# Altium project Main Board.PrjPcb
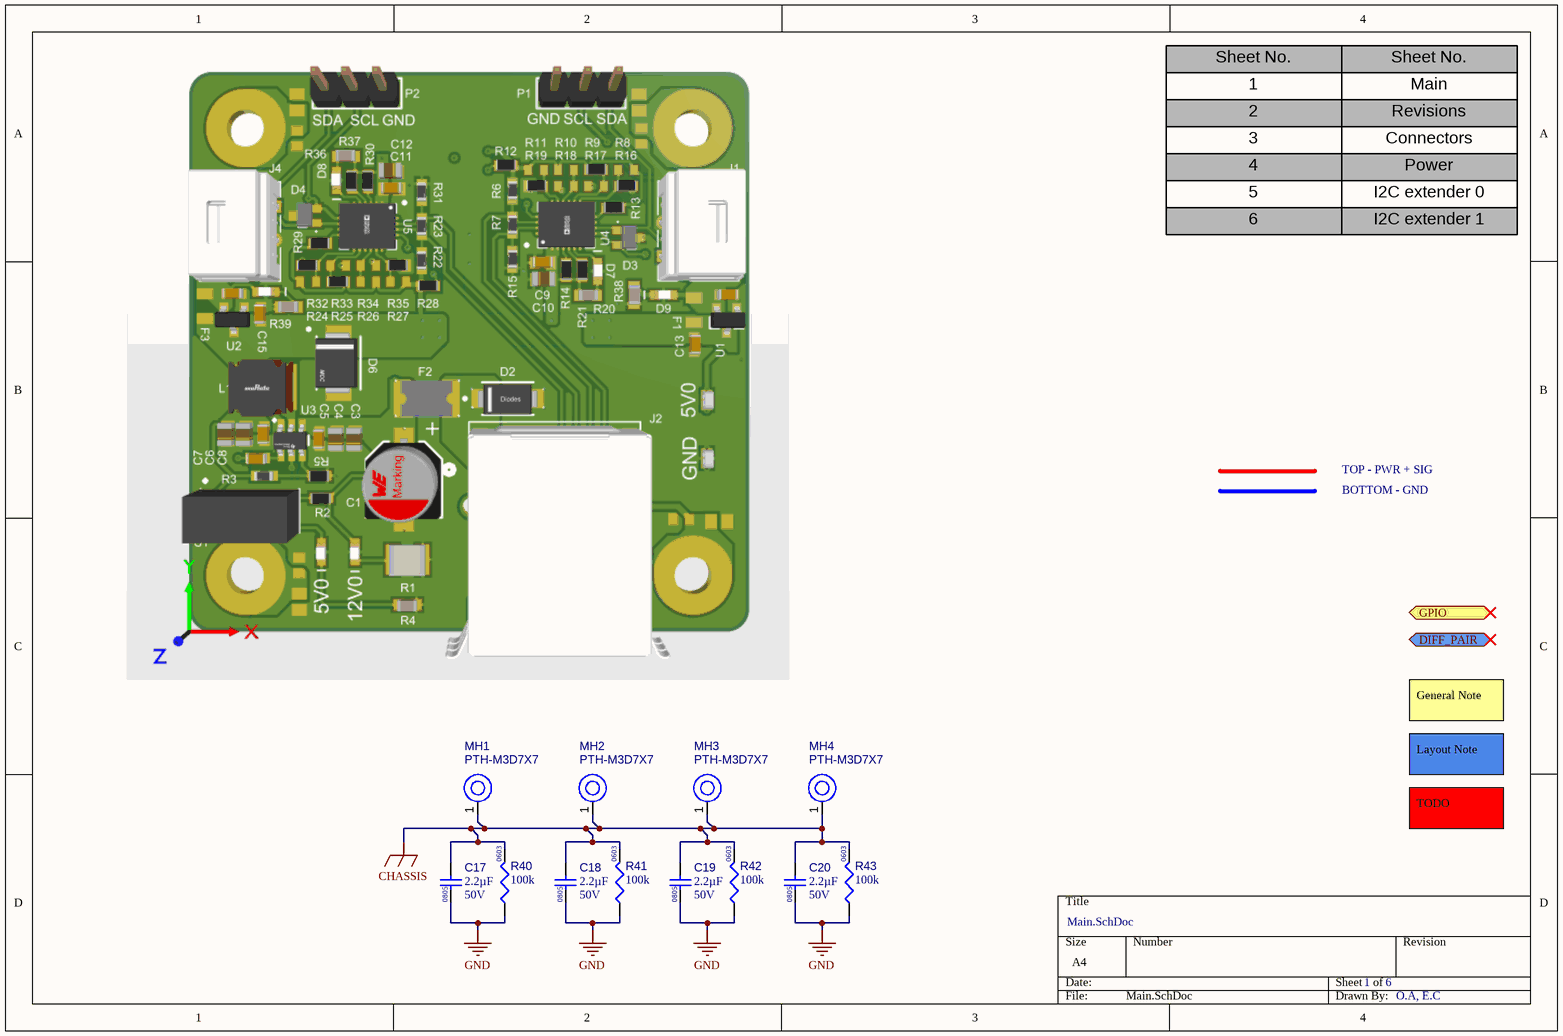
[diagram p0: Main.SchDoc]
5 sheets, 94 parts. Net scope: flat (ports and power ports of the same name join across sheets).
Board file: PCB.PcbDoc
Sheets:
  Main.SchDoc
  Connectors.SchDoc
  Power.SchDoc
  I2C extender 0.SchDoc
  I2C extender 1.SchDoc

## Sheet Main.SchDoc: =DocumentName
size A4; SheetNumber: 1; SheetTotal: 6

### Parts
C17  value 2.2µF  Rated DC Voltage (URdc): 50V  Case/Package: 0805  [FP-CL21-IPC_C]  (hidden comment: CL21A225KBFNNNE)
C18  value 2.2µF  Rated DC Voltage (URdc): 50V  Case/Package: 0805  [FP-CL21-IPC_C]  (hidden comment: CL21A225KBFNNNE)
C19  value 2.2µF  Rated DC Voltage (URdc): 50V  Case/Package: 0805  [FP-CL21-IPC_C]  (hidden comment: CL21A225KBFNNNE)
C20  value 2.2µF  Rated DC Voltage (URdc): 50V  Case/Package: 0805  [FP-CL21-IPC_C]  (hidden comment: CL21A225KBFNNNE)
MH1  PTH-M3D7X7  [PTH-M2D5X5]
MH2  PTH-M3D7X7  [PTH-M2D5X5]
MH3  PTH-M3D7X7  [PTH-M2D5X5]
MH4  PTH-M3D7X7  [PTH-M2D5X5]
R40  value 100k  Case/Package: 0603  [RESC1608X55X25NL10T15]  (hidden comment: RC0603FR-07100KL)
R41  value 100k  Case/Package: 0603  [RESC1608X55X25NL10T15]  (hidden comment: RC0603FR-07100KL)
R42  value 100k  Case/Package: 0603  [RESC1608X55X25NL10T15]  (hidden comment: RC0603FR-07100KL)
R43  value 100k  Case/Package: 0603  [RESC1608X55X25NL10T15]  (hidden comment: RC0603FR-07100KL)

### Ports
DIFF_PAIR (bidir), GPIO (bidir)

### Nets
CHASSIS: C17.2 C18.2 C19.2 C20.2 MH1.1(H1) MH2.1(H1) MH3.1(H1) MH4.1(H1) R40.2 R41.2 R42.2 R43.2
GND: C17.1 C18.1 C19.1 C20.1 R40.1 R41.1 R42.1 R43.1

### Notes on the sheet
- Sheet No.
- 1
- Main
- 2
- 3
- 4
- Revisions
- Connectors
- Power
- 5
- 6
- I2C extender 0
- I2C extender 1
- TOP - PWR + SIG
- BOTTOM - GND
- General Note
- Layout Note
- TODO
- O.A, E.C

### Library data of the parts
C17-C20 = CMP-001-00099-1: Ceramic Capacitor, Multilayer, Ceramic, 50V, 10% +Tol, 10% -Tol, X5R, 15% TC, 2.2uF, Surface Mount, 0805; Multilayer: Yes; Dielectric Material: Ceramic; Length: 2mm; Pins: 2; Tolerance  (fill in as +-): 10%; RoHS Compliant: Yes; Package Style: SMTMeter; Reach SVHC Compliant: Yes; Min Operating Temperature: -55°C; Temperature Characteristics Code: X5R; Tolerance (fill in as +-): 10%; Capacitor Type: Ceramic; Width: 1.25mm; Terminal Finish: Nickel; Termination: Wraparound; Package Shape: Rectangular; Packaging: Tape and Reel; Mounting Technology: Surface Mount; JESD-609 Code: e3; Height: 1.25mm; Max Operating Temperature: 85°C
MH1-MH4 = CMP-00028-00009-3: M3 PTH (3.3mm), 7mm pad; Pins: 1
R40-R43 = CMP-009-00195-1: Fixed Resistor, Metal Glaze/thick Film, 0.1W, 100000ohm, 75V, 1% +/-Tol, 100ppm/Cel, Surface Mount, 0603; Power: 100mW; Voltage Rating: 50V; Package Length: 1.6mm; Package Height: 0.45mm; Rated Temperature: 70°C; Package Width: 0.8mm; Temperature Coefficient: 100ppm/°C; Additional Feature: LASER TRIMMABLE; Pins: 2; Reach SVHC Compliant: Yes; Terminal Finish: Nickel; RoHS Compliant: Yes; Technology: METAL GLAZE/THICK FILM; JESD-609 Code: e3; Working Voltage: 75V; Construction: Chip; Mounting Technology: Surface Mount; Package Style: SMTMeter; Packaging: Tape and Reel; Min Operating Temperature: -55°C; Termination: Wraparound; Tolerance: 1%; Package Shape: Rectangular; Max Operating Temperature: 155°C; Resistor Type: FIXED RESISTOR

## Sheet Connectors.SchDoc
size A4; SheetNumber: 3; SheetTotal: 6
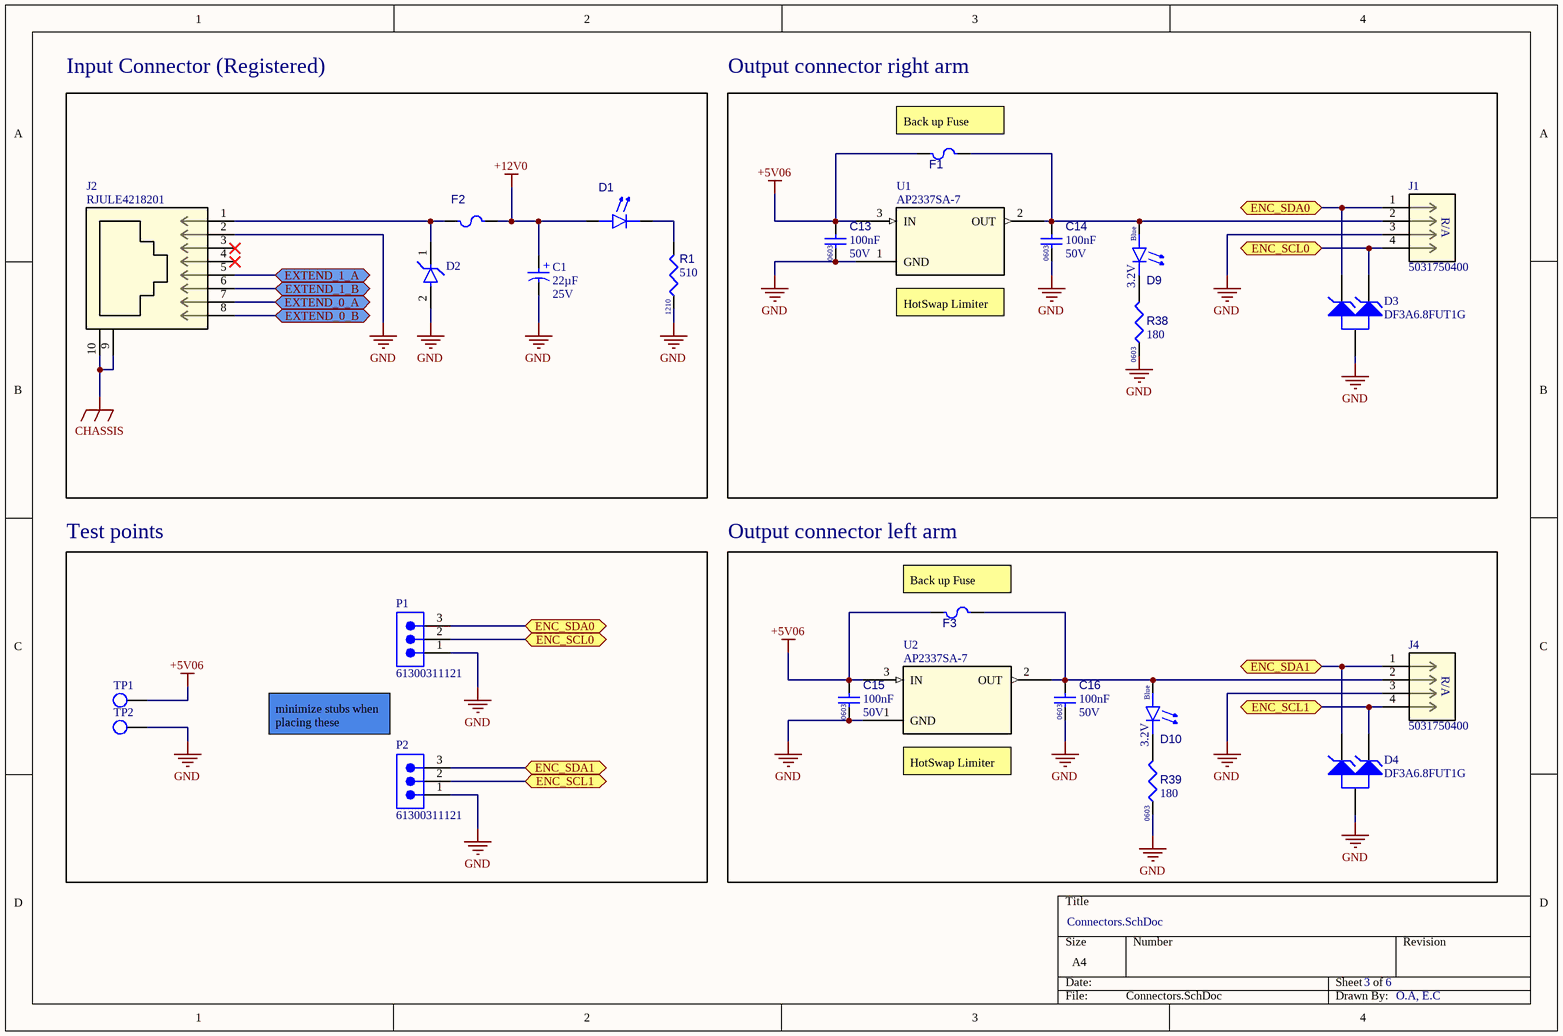
[diagram p1: Connectors.SchDoc]

### Parts
C1  value 22µF  Voltage Rating: 25V  [WCAP-PSLP_D6.3H5.8]  (hidden comment: 875105544003)
C13  value 100nF  Voltage Rating: 50V  Case/Package: 0603  [CAPC1608X90X40NL10T20]  (hidden comment: Capacitor 100 nF +/-10% 50 V 0603)
C14  value 100nF  Voltage Rating: 50V  Case/Package: 0603  [CAPC1608X90X40NL10T20]  (hidden comment: Capacitor 100 nF +/-10% 50 V 0603)
C15  value 100nF  Voltage Rating: 50V  Case/Package: 0603  [CAPC1608X90X40NL10T20]  (hidden comment: Capacitor 100 nF +/-10% 50 V 0603)
C16  value 100nF  Voltage Rating: 50V  Case/Package: 0603  [CAPC1608X90X40NL10T20]  (hidden comment: Capacitor 100 nF +/-10% 50 V 0603)
D1  150060RS75000  [WL-SMCW_0603_150060xx75000]  (value not drawn)
D2  SMAJ5.0A-13-F  [FP-SMA-MFG]  (value not drawn)
D3  DF3A6.8FUT1G  [ONSC-SC-70-3-419-04_V]
D4  DF3A6.8FUT1G  [ONSC-SC-70-3-419-04_V]
D9  Nominal Vf: 3.2V  Color: Blue  [WL-SMCW_0603_150060xx75000]  (hidden comment: 150060BS75000)
D10  Nominal Vf: 3.2V  Color: Blue  [WL-SMCW_0603_150060xx75000]  (hidden comment: 150060BS75000)
F1  MF-PSMF050X-2  [FP-MF-PSMF-MFG]  (value not drawn)
F2  MF-MSMF075-2  [BOUR-MF-MSMF050-2_V]  (value not drawn)
F3  MF-PSMF050X-2  [FP-MF-PSMF-MFG]  (value not drawn)
J1  5031750400  [5031750400-Footprint-1]
J2  RJULE4218201  [RJULE4218201-Footprint-1]
J4  5031750400  [5031750400-Footprint-1]
P1  61300311121  [61300311121]
P2  61300311121  [61300311121]
R1  value 510  Case/Package: 1210  [RESC3126X60X50NL10T20]  (hidden comment: RC1210JR-07510RL)
R38  value 180  Case/Package: 0603  [RESC0603(1608)_N]  (hidden comment: RC0603JR-07180RL)
R39  value 180  Case/Package: 0603  [RESC0603(1608)_N]  (hidden comment: RC0603JR-07180RL)
TP1  RCUCTE  [FP-S2761-46R-MFG]  (value not drawn)
TP2  RCUCTE  [FP-S2761-46R-MFG]  (value not drawn)
U1  AP2337SA-7  [SOT90P240X120-3L]
U2  AP2337SA-7  [SOT90P240X120-3L]

### Blocks framed on the sheet
Input Connector (Registered): C1 D1 D2 F2 J2 R1
Output connector right arm: C13 C14 D3 D9 F1 J1 R38 U1
Test points: P1 P2 TP1 TP2
Output connector left arm: C15 C16 D4 D10 F3 J4 R39 U2

### Ports
ENC_SCL0 (bidir), ENC_SCL1 (bidir), ENC_SDA0 (bidir), ENC_SDA1 (bidir), EXTEND_0_A (bidir), EXTEND_0_B (bidir), EXTEND_1_A (bidir), EXTEND_1_B (bidir)

### Nets
+5V06: C13.2 C15.2 F1.2 F3.2 TP1.1 U1.3(IN) U2.3(IN)
+12V0: C1.1(P) D1.2(A) F2.2
CHASSIS: J2.9 J2.10
GND: C1.2(N) C13.1 C14.1 C15.1 C16.1 D2.2(A) D3.3(A) D4.3(A) J1.3 J2.2 J4.3 P1.1 P2.1 R1.1 R38.1 R39.1 TP2.1 U1.1(GND) U2.1(GND)
NetC14_2: C14.2 D9.2(A) F1.1 J1.2 U1.2(OUT)
NetC16_2: C16.2 D10.2(A) F3.1 J4.2 U2.2(OUT)
NetD1_1: D1.1(K) R1.2
NetD2_1: D2.1(C) F2.1 J2.1
NetD3_1: D3.1(K1) J1.1 P1.3 ; port ENC_SDA0
NetD3_2: D3.2(K2) J1.4 P1.2 ; port ENC_SCL0
NetD4_1: D4.1(K1) J4.1 P2.3 ; port ENC_SDA1
NetD4_2: D4.2(K2) J4.4 P2.2 ; port ENC_SCL1
NetD9_1: D9.1(K) R38.2
NetD10_1: D10.1(K) R39.2
NetJ2_5: J2.5 ; port EXTEND_1_A
NetJ2_6: J2.6 ; port EXTEND_1_B
NetJ2_7: J2.7 ; port EXTEND_0_A
NetJ2_8: J2.8 ; port EXTEND_0_B

Not connected (* = marked no-connect by the designer): J2 3* 4*

### Notes on the sheet
- (near F1) Back up Fuse
- (near U1) HotSwap Limiter
- (near F3) Back up Fuse
- minimize stubs when placing these
- (near U2) HotSwap Limiter
- O.A, E.C
- (in symbol CMP-001-00085-2) +
- (in symbol CMP-002-00074-2) R/A

### Library data of the parts
C1 = CMP-001-00085-2: 22 µF 25 V Aluminum - Polymer Capacitors Radial, Can - SMD 30mOhm 2000 Hrs @ 105°C; Tolerance: 20%; Capacitor Type: Aluminium; Pins: 2; RoHS Compliant: Yes
C13-C16 = CMP-001-00017-8: Chip Capacitor, 100 nF, +/- 10%, 50 V, 0603 (1608 Metric); Capacitor Type: Ceramic; Tolerance: 10%; Mounting Technology: SM; Max Operating Temperature: 125°C; RoHS Compliant: True; Pins: 2; Min Operating Temperature: -55°C
D1 = CMP-007-00036-1: Single Color LED, Red, Water Clear, 1.1mm; Forward Current: 30mA; Max Operating Temperature: 85°C; Mounting Technology: Surface Mount; RoHS Compliant: Yes; Pins: 2; Min Operating Temperature: -40°C
D2 = CMP-004-00031-3: Trans Voltage Suppressor Diode, 400W, 5V V(RWM), Unidirectional, 1 Element, Silicon; RoHS Compliant: Yes; Max Operating Temperature: 150°C; Min Operating Temperature: -55°C; Pins: 2
D3 D4 = CMP-004-00039-1: Trans Voltage Suppressor Diode, 150W, Unidirectional, 2 Element, Silicon; Dynamic Impedance-Max: 50R; Time @ Peak Reflow Temperature-Max (s): 40s; Test Current: 5mA; Max Power Dissipation: 200mW; Package Body Material: Plastic; Number of Elements: 2; Voltage Tol-Max: 5.9%; Max Breakdown Voltage: 7.2V; Qualification Status: Not Qualified; Min Breakdown Voltage: 6.4V; Reference Voltage-Nom: 6.8V; Terminal Form: Gull Wing; Reach SVHC Compliant: Yes; Package Shape: Rectangular; Terminal Finish: Tin; Terminal Position: DUAL; JESD-609 Code: e3; Non-rep Peak Rev Power Dis-Max: 150W; Surface Mount: Yes; Diode Type: TRANS VOLTAGE SUPPRESSOR; Technology: ZENER; Polarity: Unidirectional; Max Operating Temperature: 150°C; Moisture Sensitivity Level: 1; Diode Element Material: SILICON; Min Operating Temperature: -55°C; Package Style: SMALL OUTLINEMeter; Pins: 3; Peak Reflow Temperature (Cel): 260°C; JESD-30 Code: R-PDSO-G3; RoHS Compliant: Yes
D9 D10 = CMP-007-00037-2: Single Color LED, Blue, Water Clear, 1.1mm; Channels: 1; Luminous Intensity-Nom: 145mcd; Overall Height: 0.7mm; Shape: Rectangular; Viewing Angle: 140°; Forward Current: 30mA; Pins: 2; Lens Style: WATER CLEAR; Mounting Technology: Surface Mount; Optoelectronic Device Type: SINGLE COLOR LED; Packaging: Tape and Reel; RoHS Compliant: Yes; Colour: Blue; Terminal Pitch: 1.6mm; Min Operating Temperature: -40°C; Size: 1.1mm; Reach SVHC Compliant: Yes; Max Operating Temperature: 85°C
F1 F3 = CMP-005-00014-1: PTC Resettable Fuse, 6V, Surface Mount; Power: 500mW; Thermistor Application: OVERLOAD PROTECTION; Min Operating Temperature: -40°C; Pins: 2; Reach SVHC Compliant: Yes; Resistor Type: PTC RESETTABLE FUSE; JESD-609 Code: e4; RoHS Compliant: Yes; Packaging: Tape and Reel; Max Operating Temperature: 85°C; Package Shape: Rectangular; Mounting Technology: Surface Mount; Termination: Wraparound; Terminal Placement: Dual Ended; Terminal Finish: Nickel; Rated AC Voltage (URac): 6V
F2 = CMP-005-00013-2: PTC Resettable Fuse, 13.2V, Surface Mount; Reference Standard: AEC-Q200; Thermistor Application: OVERLOAD PROTECTION; Package Length: 4.73mm; Package Width: 3.41mm; Package Height: 0.85mm; Power: 800mW; Rated Temperature: 85°C; Min Operating Temperature: -40°C; Rated AC Voltage (URac): 13.2V; Terminal Finish: Nickel; Termination: Wraparound; Packaging: Tape and Reel; Package Shape: Rectangular; Resistor Type: PTC RESETTABLE FUSE; Max Operating Temperature: 85°C; Reach SVHC Compliant: Yes; Pins: 2; JESD-609 Code: e4; RoHS Compliant: Yes; Terminal Placement: Dual Ended; Mounting Technology: Surface Mount; Package Style: SMTMeter
J1 J4 = CMP-002-00074-2: DIP Connector, 4 Contact(s), 2 Row(s), Female, Right Angle, 0.059 inch Pitch, Solder Terminal, Locking, Beige Insulator, Receptacle; Connector Type: DIP; Min Operating Temperature: -85°C; Mounting Technology: Board; RoHS Compliant: Yes; Max Operating Temperature: 85°C
J2 = CMP-002-00075-4: Modular Jack - Right Angle, Input Output Connectors RJ45, 8P8C, Without LEDs, Shield.
P1 P2 = CMP-002-00076-1: Board Connector, 3 Contact(s), 1 Row(s), Male, Straight, 0.1 inch Pitch, Solder Terminal, Locking, Black Insulator, Plug; Min Operating Temperature: -40°C; Connector Type: BOARD CONNECTOR; RoHS Compliant: Yes; Mounting Technology: Board; Max Operating Temperature: 125°C
R1 = CMP-009-00179-1: Fixed Resistor, Metal Glaze/thick Film, 0.5W, 510ohm, 200V, 5% +/-Tol, 100ppm/Cel, Surface Mount, 1210; Power: 500mW; Pins: 2; Min Operating Temperature: -55°C; Mounting Technology: Surface Mount; Max Operating Temperature: 155°C; RoHS Compliant: Yes; Tolerance: 5%
R38 R39 = CMP-009-00178-1: Fixed Resistor, Metal Glaze/thick Film, 0.1W, 180ohm, 75V, 5% +/-Tol, 100ppm/Cel, Surface Mount, 0603; Power: 100mW; Tolerance: 5%; Pins: 2; Mounting Technology: Surface Mount; RoHS Compliant: Yes; Max Operating Temperature: 155°C; Min Operating Temperature: -55°C
TP1 TP2 = CMP-002-00072-5: Test point; Connector Type: Interconnection Device; Pins: 2; Max Operating Temperature: 125°C; Case/Package: 0603; Mounting Technology: Surface Mount; RoHS Compliant: Yes; Min Operating Temperature: -55°C
U1 U2 = CMP-015-00012-4: Power Supply Support Circuit, Fixed, 1 Channel, PDSO3; Adjustable Threshold: No; Qualification Status: Not Qualified; Max Supply Voltage: 5.5V; Channels: 1; Min Supply Voltage: 2.7V; Package Body Material: Plastic; Time @ Peak Reflow Temperature-Max (s): 40s; Nominal Supply Voltage: 5V; Peak Reflow Temperature (Cel): 260°C; JESD-609 Code: e3; Length: 2.9mm; Surface Mount: Yes; Case/Package: SOP; Package Shape: Rectangular; RoHS Compliant: Yes; Moisture Sensitivity Level: 1; Temperature Grade: INDUSTRIAL; Number of Channels: 1; Package Style: SMALL OUTLINEMeter; Width: 1.3mm; Max Operating Temperature: 85°C; JESD-30 Code: R-PDSO-G3; Height - Seated (Max): 1.2mm; Terminal Position: DUAL; Pins: 3; Min Operating Temperature: -40°C; Terminal Finish: Tin; Throw Configuration: POWER SUPPLY SUPPORT CIRCUIT; Reach SVHC Compliant: Yes; Terminal Pitch: 0.915mm; Terminal Form: Gull Wing

## Sheet Power.SchDoc
size A4; SheetNumber: 4; SheetTotal: 6
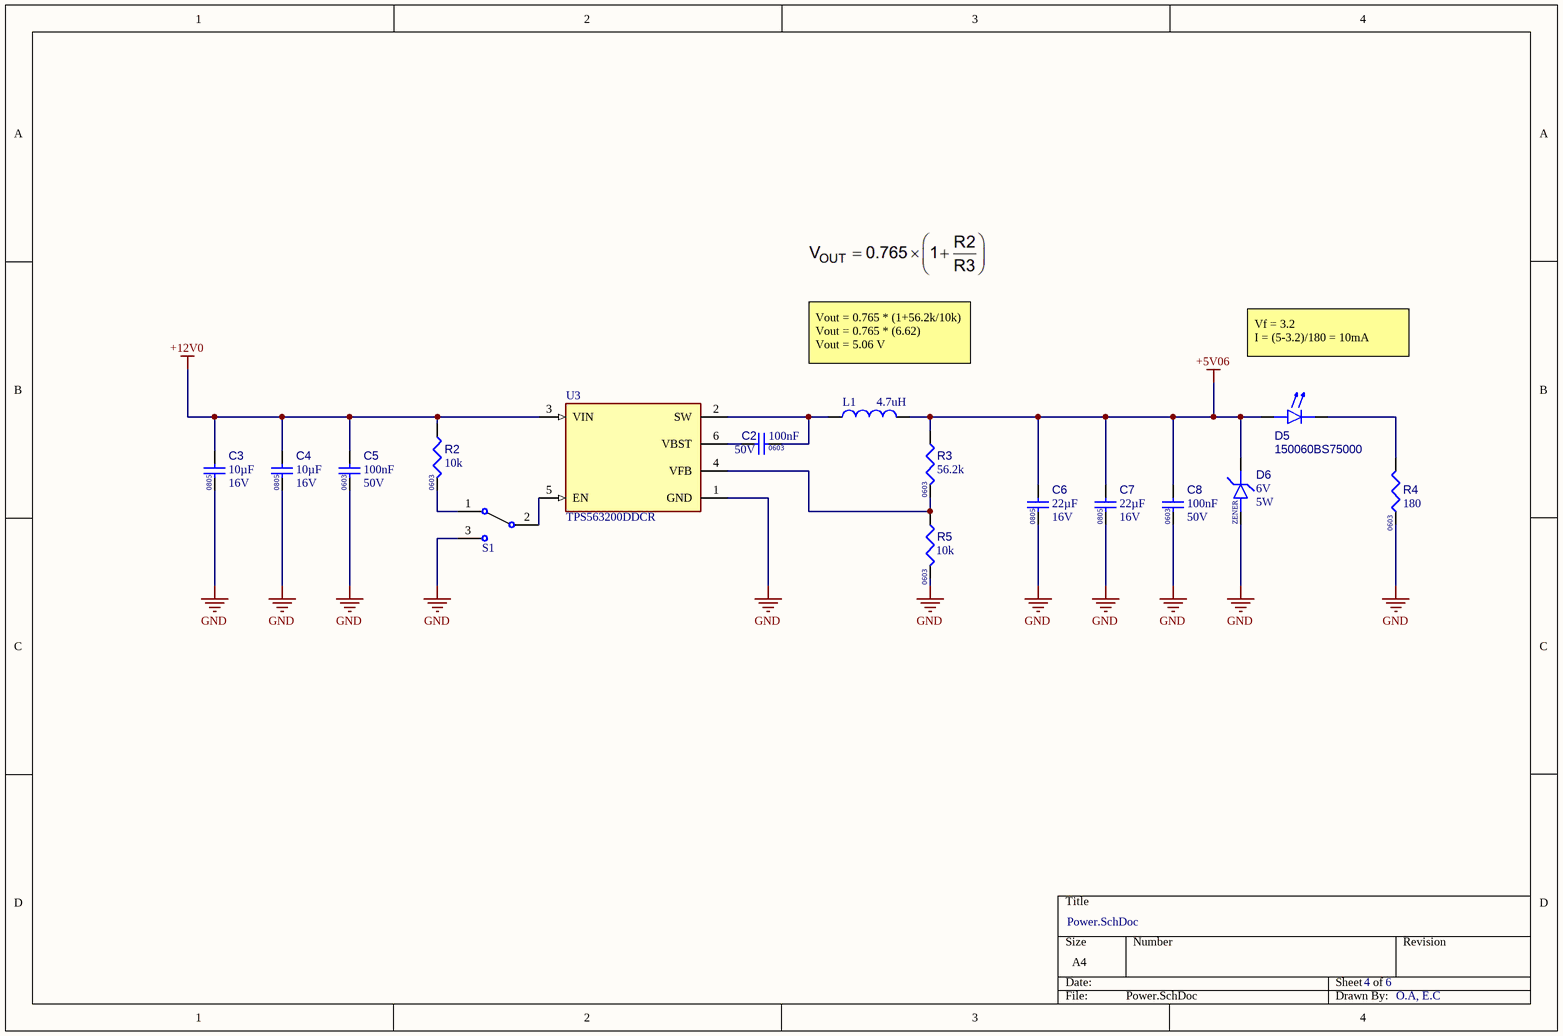
[diagram p2: Power.SchDoc]

### Parts
C2  value 100nF  Voltage Rating: 50V  Case/Package: 0603  [CAPC1608X90X40NL10T20]  (hidden comment: Capacitor 100 nF +/-10% 50 V 0603)
C3  value 10µF  Voltage Rating: 16V  Case/Package: 0805  [CAP CER 10UF 16V X5R 0805-Footprint-1]  (hidden comment: CAP CER 10UF 16V X5R 0805)
C4  value 10µF  Voltage Rating: 16V  Case/Package: 0805  [CAP CER 10UF 16V X5R 0805-Footprint-1]  (hidden comment: CAP CER 10UF 16V X5R 0805)
C5  value 100nF  Voltage Rating: 50V  Case/Package: 0603  [CAPC1608X90X40NL10T20]  (hidden comment: Capacitor 100 nF +/-10% 50 V 0603)
C6  value 22µF  Voltage Rating: 16V  Case/Package: 0805  [CL21A226MOQNNNE-Footprint-1]  (hidden comment: CL21A226MOQNNNE)
C7  value 22µF  Voltage Rating: 16V  Case/Package: 0805  [CL21A226MOQNNNE-Footprint-1]  (hidden comment: CL21A226MOQNNNE)
C8  value 100nF  Voltage Rating: 50V  Case/Package: 0603  [CAPC1608X90X40NL10T20]  (hidden comment: Capacitor 100 nF +/-10% 50 V 0603)
D5  150060BS75000  [WL-SMCW_0603_150060xx75000]
D6  Reference Voltage-Nom: 6V  Max Power Dissipation: 5W  Diode Type: ZENER  [FP-DO-214AA-MFG]  (hidden comment: SMBJ5340B-TP)
L1  Inductance-Nom (L): 4.7uH  [FP-LQH5BPN_38-MFG]  (hidden comment: LQH5BPN4R7N38L)
R2  value 10k  Case/Package: 0603  [RESC1608X55X25NL10T15]  (hidden comment: Resistor 10k +/-1% 0603 100 mW)
R3  value 56.2k  Case/Package: 0603  [RC0603JR-0730KL-Footprint-1]  (hidden comment: RC0603FR-0756K2L)
R4  value 180  Case/Package: 0603  [RESC0603(1608)_N]  (hidden comment: RC0603JR-07180RL)
R5  value 10k  Case/Package: 0603  [RESC1608X55X25NL10T15]  (hidden comment: Resistor 10k +/-1% 0603 100 mW)
S1  SLW-883935-2A-D  [SLW-883935-2A-D-Footprint-1]  (value not drawn)
U3  TPS563200DDCR  [FP-DDC0006A-MFG]

### Nets
+5V06: C6.2 C7.2 C8.2 D5.2(A) D6.1(K) L1.1 R3.2
+12V0: C3.2 C4.2 C5.2 R2.2 U3.3(VIN)
GND: C3.1 C4.1 C5.1 C6.1 C7.1 C8.1 D6.2(A) R4.1 R5.1 S1.3(NO) U3.1(GND)
NetC2_1: C2.1 L1.2 U3.2(SW)
NetC2_2: C2.2 U3.6(VBST)
NetD5_1: D5.1(K) R4.2
NetR2_1: R2.1 S1.1(NC)
NetR3_1: R3.1 R5.2 U3.4(VFB)
NetS1_2: S1.2(COM) U3.5(EN)

### Notes on the sheet
- Vout = 0.765 * (1+56.2k/10k)
  Vout = 0.765 * (6.62)
  Vout = 5.06 V
- Vf = 3.2
  I = (5-3.2)/180 = 10mA
- O.A, E.C

### Library data of the parts
C2 C5 C8 = CMP-001-00017-8: as C13 on sheet Connectors; Tolerance: 10%; Mounting Technology: SM; Max Operating Temperature: 125°C; RoHS Compliant: True; Pins: 2; Min Operating Temperature: -55°C
C3 C4 = CMP-001-00084-6: Ceramic Capacitor, Multilayer, Ceramic, 16V, 10% +Tol, 10% -Tol, X5R, 15% TC, 10uF, Surface Mount, 0805; Pins: 2; Capacitor Type: Ceramic; Max Operating Temperature: 85°C; Min Operating Temperature: -55°C; RoHS Compliant: Yes; Mounting Technology: Surface Mount
C6 C7 = CMP-001-00087-3: Ceramic Capacitor, Multilayer, Ceramic, 16V, 20% +Tol, 20% -Tol, X5R, 15% TC, 22uF, Surface Mount, 0805; Min Operating Temperature: -55°C; Mounting Technology: Surface Mount; Max Operating Temperature: 85°C; Capacitor Type: Ceramic; Pins: 2; RoHS Compliant: Yes
D5 = CMP-007-00037-2: Single Color LED, Blue, Water Clear, 1.1mm; Nominal Vf: 3.2V; Channels: 1; Luminous Intensity-Nom: 145mcd; Overall Height: 0.7mm; Shape: Rectangular; Viewing Angle: 140°; Forward Current: 30mA; Pins: 2; Lens Style: WATER CLEAR; Mounting Technology: Surface Mount; Optoelectronic Device Type: SINGLE COLOR LED; Packaging: Tape and Reel; Color: Blue; RoHS Compliant: Yes; Colour: Blue; Terminal Pitch: 1.6mm; Min Operating Temperature: -40°C; Size: 1.1mm; Reach SVHC Compliant: Yes; Max Operating Temperature: 85°C
D6 = CMP-004-00036-2: Zener Diode, 6V V(Z), 5%, 5W, Silicon, Unidirectional, DO-214AA; Time @ Peak Reflow Temperature-Max (s): 10s; Test Current: 200mA; Package Body Material: Plastic; Qualification Status: Not Qualified; Dynamic Impedance-Max: 1R; Number of Elements: 1; JEDEC-95 Code: DO-214AA; Min Operating Temperature: -55°C; Package Shape: Rectangular; RoHS Compliant: Yes; Terminal Finish: Tin; Terminal Form: C BEND; Peak Reflow Temperature (Cel): 260°C; Terminal Position: DUAL; Technology: ZENER; JESD-609 Code: e3; Diode Element Material: SILICON; Polarity: Unidirectional; Pins: 2; Voltage Tol-Max: 5%; Moisture Sensitivity Level: 1; Reach SVHC Compliant: No; JESD-30 Code: R-PDSO-C2; Max Operating Temperature: 150°C; Package Style: SMALL OUTLINEMeter; Surface Mount: Yes
L1 = CMP-006-00023-1: General Purpose Inductor, 4.7uH, 30%, 1 Element, Ferrite-Core, SMD, 1919; Max Current Rating: 3.8A; Channels: 1; DC Resistance (DCR): 31.2mR; Self Resonant Frequency: 17MHz; Shielding: Shielded; Shape/Size Description: RECTANGULAR PACKAGE; Test Frequency: 100kHz; Inductor Application: RF INDUCTOR; Tolerance: 30%; Core Material: Ferrite; Min Operating Temperature: -40°C; Pins: 2; Terminal Placement: Dual Ended; RoHS Compliant: Yes; Surface Mount: Yes; Inductor Type: GENERAL PURPOSE INDUCTOR; Termination: One Surface; Reach SVHC Compliant: Yes; Max Operating Temperature: 125°C
R2 R5 = CMP-009-00017-7: Chip Resistor, 10 KOhm, +/- 1%, 01 W, -55 to 155 degC, 0603 (1608 Metric); Voltage Rating: 50V; Power: 100mW; RoHS Compliant: True; Min Operating Temperature: -55°C; Pins: 2; Mounting Technology: SM; Max Operating Temperature: 155°C; Tolerance: 1%
R3 = CMP-009-00192-1: Fixed Resistor, Metal Glaze/thick Film, 0.1W, 56200ohm, 75V, 1% +/-Tol, 100ppm/Cel, Surface Mount, 0603; Package Length: 1.6mm; Additional Feature: LASER TRIMMABLE; Temperature Coefficient: 100ppm/°C; Package Height: 0.45mm; Rated Temperature: 70°C; Package Width: 0.8mm; Power: 100mW; Termination: Wraparound; Reach SVHC Compliant: Yes; Resistor Type: FIXED RESISTOR; JESD-609 Code: e3; Max Operating Temperature: 155°C; Construction: Chip; Terminal Finish: Nickel; Pins: 2; Mounting Technology: Surface Mount; Working Voltage: 75V; RoHS Compliant: Yes; Technology: METAL GLAZE/THICK FILM; Min Operating Temperature: -55°C; Package Shape: Rectangular; Tolerance: 1%; Package Style: SMTMeter; Packaging: Tape and Reel
R4 = CMP-009-00178-1: as R38 on sheet Connectors; Tolerance: 5%; Pins: 2; Mounting Technology: Surface Mount; RoHS Compliant: Yes; Max Operating Temperature: 155°C; Min Operating Temperature: -55°C
S1 = CMP-011-00017-1: 8.8 X 3.9 X 3.5 Mm, 2 Mm Raised
U3 = CMP-019-00052-1: Switching Regulator, 3A, 650kHz Switching Freq-Max, PDSO6; Switcher Configuration: BUCK; Channels: 1; Package Body Material: Plastic; Max Output current: 5.3A; Max Supply Voltage: 17V; Min Input Voltage: 4.5V; Control Technique: PULSE WIDTH MODULATION; Nominal Supply Voltage: 12V; Reach SVHC Compliant: Yes; RoHS Compliant: Yes; Temperature Grade: INDUSTRIAL; Terminal Finish: Tin; Throw Configuration: SWITCHING REGULATOR; Terminal Pitch: 0.95mm; Terminal Position: DUAL; Frequency: 650kHz; JESD-30 Code: R-PDSO-G6; Surface Mount: Yes; Min Operating Temperature: -40°C; Pins: 6; Peak Reflow Temperature (Cel): 260°C; JESD-609 Code: e3; Package Style: SMALL OUTLINE, THIN PROFILE, SHRINK PITCHMeter; Length: 2.9mm; Max Operating Temperature: 85°C; Width: 1.6mm; Package Shape: Rectangular; Terminal Form: Gull Wing; Case/Package: TSSOP; Height - Seated (Max): 1.1mm; Moisture Sensitivity Level: 1

## Sheet I2C extender 0.SchDoc
size A4; SheetNumber: 5; SheetTotal: 6
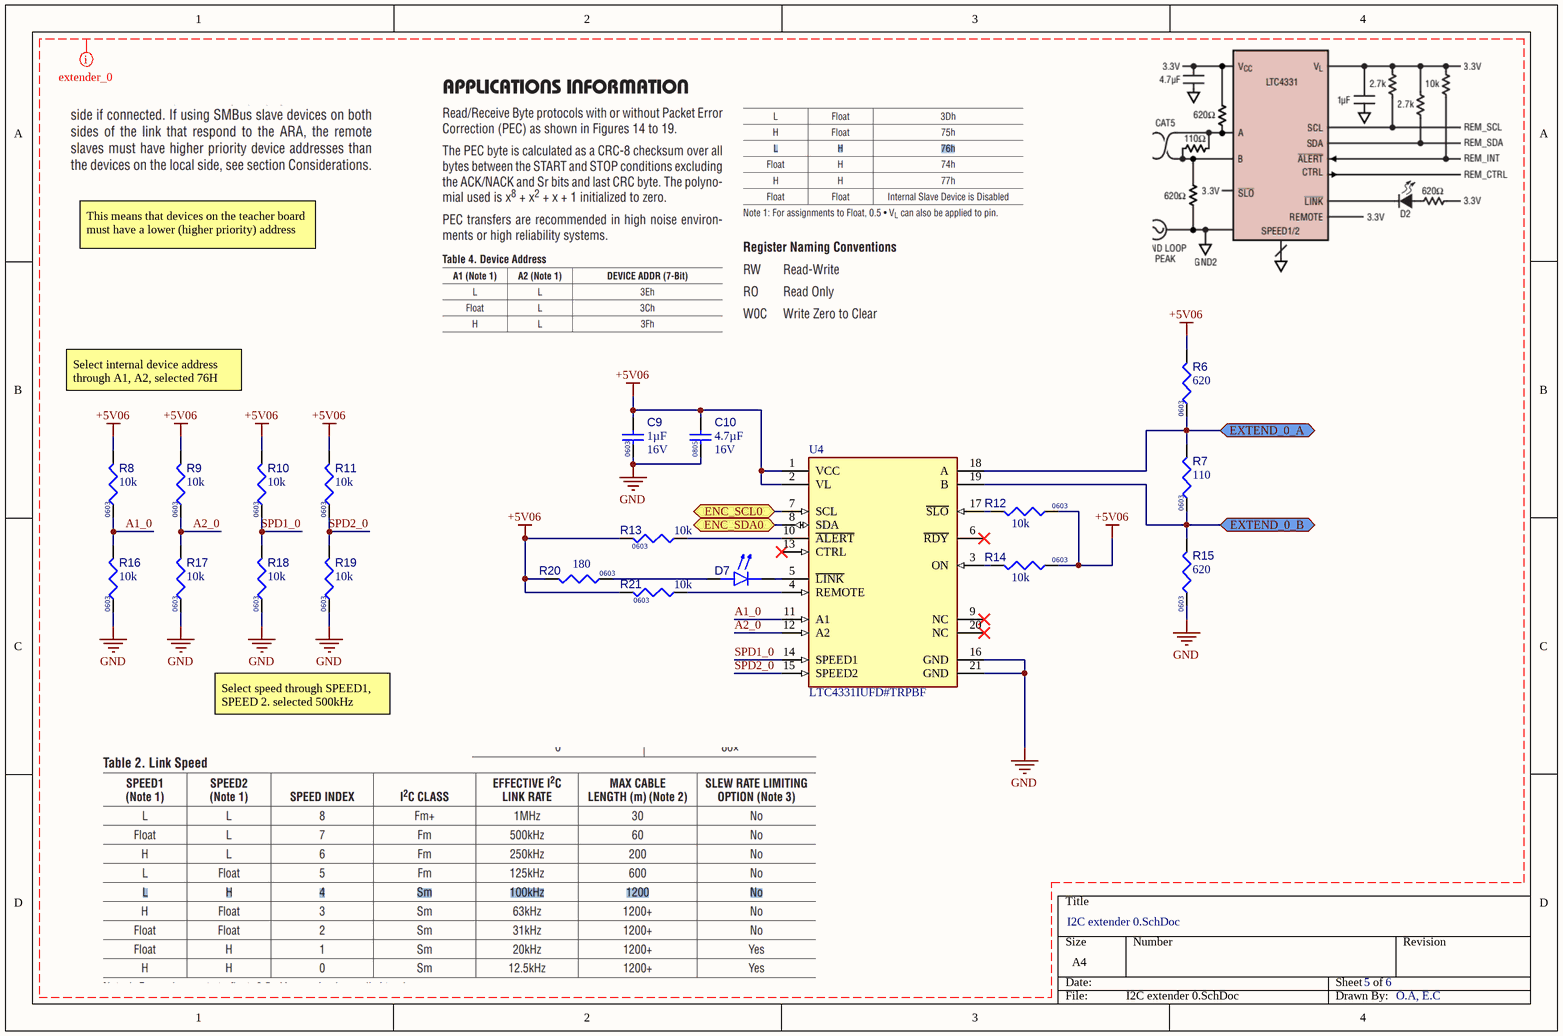
[diagram p3: I2C extender 0.SchDoc]

### Parts
C9  value 1µF  Case/Package: 0603  Voltage Rating: 16V  [CAPC1608X90X35NL15T15]  (hidden comment: Capacitor 1uF +/- 10% 16V 0603)
C10  value 4.7µF  Case/Package: 0805  Rated DC Voltage (URdc): 16V  [CL21A475KOFNNNE-Footprint-1]  (hidden comment: CL21A475KOFNNNE)
D7  150060YS75000  [WL-SMCW_0603_150060xx75000]  (value not drawn)
R6  value 620  Case/Package: 0603  [RC0603JR-0720KL-Footprint-1]  (hidden comment: RC0603FR-07620RL)
R7  value 110  Case/Package: 0603  [RC0603JR-0720KL-Footprint-1]  (hidden comment: RC0603FR-07110RL)
R8  value 10k  Case/Package: 0603  [RESC1608X55X25NL10T15]  (hidden comment: Resistor 10k +/-1% 0603 100 mW)
R9  value 10k  Case/Package: 0603  [RESC1608X55X25NL10T15]  (hidden comment: Resistor 10k +/-1% 0603 100 mW)
R10  value 10k  Case/Package: 0603  [RESC1608X55X25NL10T15]  (hidden comment: Resistor 10k +/-1% 0603 100 mW)
R11  value 10k  Case/Package: 0603  [RESC1608X55X25NL10T15]  (hidden comment: Resistor 10k +/-1% 0603 100 mW)
R12  value 10k  Case/Package: 0603  [RESC1608X55X25NL10T15]  (hidden comment: Resistor 10k +/-1% 0603 100 mW)
R13  value 10k  Case/Package: 0603  [RESC1608X55X25NL10T15]  (hidden comment: Resistor 10k +/-1% 0603 100 mW)
R14  value 10k  Case/Package: 0603  [RESC1608X55X25NL10T15]  (hidden comment: Resistor 10k +/-1% 0603 100 mW)
R15  value 620  Case/Package: 0603  [RC0603JR-0720KL-Footprint-1]  (hidden comment: RC0603FR-07620RL)
R16  value 10k  Case/Package: 0603  [RESC1608X55X25NL10T15]  (hidden comment: Resistor 10k +/-1% 0603 100 mW)
R17  value 10k  Case/Package: 0603  [RESC1608X55X25NL10T15]  (hidden comment: Resistor 10k +/-1% 0603 100 mW)
R18  value 10k  Case/Package: 0603  [RESC1608X55X25NL10T15]  (hidden comment: Resistor 10k +/-1% 0603 100 mW)
R19  value 10k  Case/Package: 0603  [RESC1608X55X25NL10T15]  (hidden comment: Resistor 10k +/-1% 0603 100 mW)
R20  value 180  Case/Package: 0603  [RESC0603(1608)_N]  (hidden comment: RC0603JR-07180RL)
R21  value 10k  Case/Package: 0603  [RESC1608X55X25NL10T15]  (hidden comment: Resistor 10k +/-1% 0603 100 mW)
U4  LTC4331IUFD#TRPBF  [FP-UFD-20-05-08-1711-IPC_C]

### Ports
ENC_SCL0 (bidir), ENC_SDA0 (bidir), EXTEND_0_A (bidir), EXTEND_0_B (bidir)

### Nets
+5V06: C9.2 C10.2 R6.2 R8.2 R9.2 R10.2 R11.2 R12.1 R13.1 R14.1 R20.2 R21.1 U4.1(VCC) U4.2(VL)
GND: C9.1 C10.1 R15.1 R16.1 R17.1 R18.1 R19.1 U4.16(GND) U4.21(GND)
A1_0: R8.1 R16.2 U4.11(A1)
A2_0: R9.1 R17.2 U4.12(A2)
SPD1_0: R10.1 R18.2 U4.14(SPEED1)
SPD2_0: R11.1 R19.2 U4.15(SPEED2)
NetD3_1: U4.8(SDA) ; port ENC_SDA0
NetD3_2: U4.7(SCL) ; port ENC_SCL0
NetD7_1: D7.1(K) U4.5(~{LINK})
NetD7_2: D7.2(A) R20.1
NetJ2_7: R6.1 R7.2 U4.18(A) ; port EXTEND_0_A
NetJ2_8: R7.1 R15.2 U4.19(B) ; port EXTEND_0_B
NetR12_2: R12.2 U4.17(~{SLO})
NetR13_2: R13.2 U4.10(~{ALERT})
NetR14_2: R14.2 U4.3(ON)
NetR21_2: R21.2 U4.4(REMOTE)

Not connected (* = marked no-connect by the designer): U4 6(~{RDY})* 9(NC)* 13(CTRL)* 20(NC)*

### Layout directives
mark named extender_0: +5V06, A1_0, A2_0, GND, SPD1_0, SPD2_0

### Notes on the sheet
- This means that devices on the teacher board must have a lower (higher priority) address
- Select internal device address through A1, A2, selected 76H
- Select speed through SPEED1, SPEED 2. selected 500kHz
- O.A, E.C

### Library data of the parts
C9 = CMP-001-00004-8: Chip Capacitor, 1 uF, +/- 10%, 16 V, 0603 (1608 Metric); Capacitor Type: Ceramic; Mounting Technology: SM; RoHS Compliant: True; Min Operating Temperature: -55°C; Pins: 2; Max Operating Temperature: 125°C; Tolerance: 10%
C10 = CMP-001-00089-2: Ceramic Capacitor, Multilayer, Ceramic, 16V, 10% +Tol, 10% -Tol, X5R, 15% TC, 4.7uF, Surface Mount, 0805; Multilayer: Yes; Dielectric Material: Ceramic; Tolerance (fill in as +-): 10%; Pins: 2; Package Style: SMTMeter; Max Operating Temperature: 85°C; JESD-609 Code: e3; Termination: Wraparound; Min Operating Temperature: -55°C; RoHS Compliant: Yes; Mounting Technology: Surface Mount; Reach SVHC Compliant: Yes; Terminal Finish: Nickel; Packaging: Tape and Reel; Capacitor Type: Ceramic; Height: 1.35mm; Width: 1.25mm; Temperature Characteristics Code: X5R; Length: 2mm; Tolerance  (fill in as +-): 10%; Package Shape: Rectangular
D7 = CMP-007-00046-1: Single Color LED, Yellow, Water Clear, 1.1mm; Shape: Rectangular; Forward Current: 30mA; Forward Voltage: 2V; Viewing Angle: 140°; Channels: 1; Luminous Intensity-Nom: 120mcd; Overall Height: 0.7mm; Packaging: Tape and Reel; Size: 1.1mm; Max Operating Temperature: 85°C; RoHS Compliant: Yes; Color: Yellow; Pins: 2; Lens Style: WATER CLEAR; Reach SVHC Compliant: Yes; Terminal Pitch: 1.6mm; Mounting Technology: Surface Mount; Min Operating Temperature: -40°C; Optoelectronic Device Type: SINGLE COLOR LED
R6 R15 = CMP-009-00191-1: Fixed Resistor, Metal Glaze/thick Film, 0.1W, 620ohm, 75V, 1% +/-Tol, 100ppm/Cel, Surface Mount, 0603; Power: 100mW; Additional Feature: LASER TRIMMABLE; Package Height: 0.45mm; Package Width: 0.8mm; Temperature Coefficient: 100ppm/°C; Rated Temperature: 70°C; Package Length: 1.6mm; Package Shape: Rectangular; Min Operating Temperature: -55°C; Technology: METAL GLAZE/THICK FILM; Reach SVHC Compliant: Yes; Pins: 2; Working Voltage: 75V; Tolerance: 1%; Terminal Finish: Nickel; RoHS Compliant: Yes; Termination: Wraparound; Construction: Chip; JESD-609 Code: e3; Mounting Technology: Surface Mount; Max Operating Temperature: 155°C; Package Style: SMTMeter; Packaging: Tape and Reel; Resistor Type: FIXED RESISTOR
R7 = CMP-009-00190-1: Fixed Resistor, Metal Glaze/thick Film, 0.1W, 110ohm, 75V, 1% +/-Tol, 100ppm/Cel, Surface Mount, 0603; Package Length: 1.6mm; Temperature Coefficient: 100ppm/°C; Power: 100mW; Package Height: 0.45mm; Package Width: 0.8mm; Additional Feature: LASER TRIMMABLE; Rated Temperature: 70°C; Termination: Wraparound; JESD-609 Code: e3; RoHS Compliant: Yes; Tolerance: 1%; Max Operating Temperature: 155°C; Package Style: SMTMeter; Terminal Finish: Nickel; Packaging: Tape and Reel; Package Shape: Rectangular; Pins: 2; Working Voltage: 75V; Construction: Chip; Resistor Type: FIXED RESISTOR; Technology: METAL GLAZE/THICK FILM; Reach SVHC Compliant: Yes; Mounting Technology: Surface Mount; Min Operating Temperature: -55°C
R8-R14 R16-R19 R21 = CMP-009-00017-7: as R2 on sheet Power; RoHS Compliant: True; Min Operating Temperature: -55°C; Pins: 2; Mounting Technology: SM; Max Operating Temperature: 155°C; Tolerance: 1%
R20 = CMP-009-00178-1: as R38 on sheet Connectors; Tolerance: 5%; Pins: 2; Mounting Technology: Surface Mount; RoHS Compliant: Yes; Max Operating Temperature: 155°C; Min Operating Temperature: -55°C
U4 = CMP-015-00011-1: Interface Circuit, CMOS, PQCC20; Throw Configuration: POWER SUPPLY SUPPORT CIRCUIT; Reach SVHC Compliant: Yes; RoHS Compliant: Yes

## Sheet I2C extender 1.SchDoc
size A4; SheetNumber: 6; SheetTotal: 6
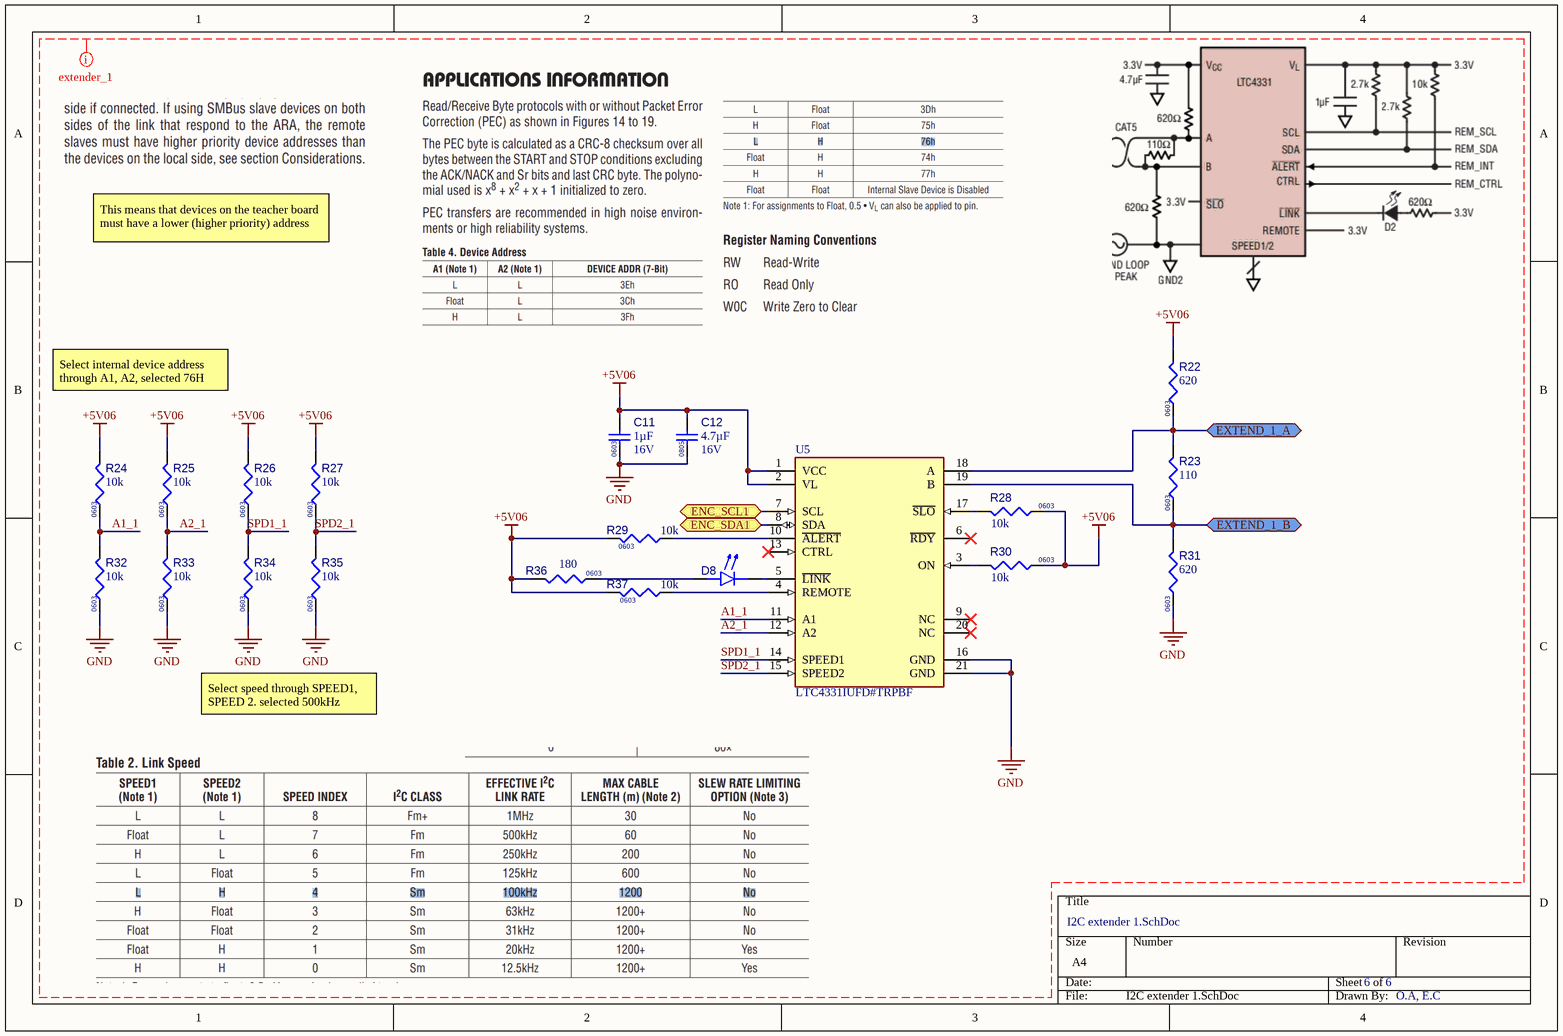
[diagram p4: I2C extender 1.SchDoc]

### Parts
C11  value 1µF  Case/Package: 0603  Voltage Rating: 16V  [CAPC1608X90X35NL15T15]  (hidden comment: Capacitor 1uF +/- 10% 16V 0603)
C12  value 4.7µF  Case/Package: 0805  Rated DC Voltage (URdc): 16V  [CL21A475KOFNNNE-Footprint-1]  (hidden comment: CL21A475KOFNNNE)
D8  150060YS75000  [WL-SMCW_0603_150060xx75000]  (value not drawn)
R22  value 620  Case/Package: 0603  [RC0603JR-0720KL-Footprint-1]  (hidden comment: RC0603FR-07620RL)
R23  value 110  Case/Package: 0603  [RC0603JR-0720KL-Footprint-1]  (hidden comment: RC0603FR-07110RL)
R24  value 10k  Case/Package: 0603  [RESC1608X55X25NL10T15]  (hidden comment: Resistor 10k +/-1% 0603 100 mW)
R25  value 10k  Case/Package: 0603  [RESC1608X55X25NL10T15]  (hidden comment: Resistor 10k +/-1% 0603 100 mW)
R26  value 10k  Case/Package: 0603  [RESC1608X55X25NL10T15]  (hidden comment: Resistor 10k +/-1% 0603 100 mW)
R27  value 10k  Case/Package: 0603  [RESC1608X55X25NL10T15]  (hidden comment: Resistor 10k +/-1% 0603 100 mW)
R28  value 10k  Case/Package: 0603  [RESC1608X55X25NL10T15]  (hidden comment: Resistor 10k +/-1% 0603 100 mW)
R29  value 10k  Case/Package: 0603  [RESC1608X55X25NL10T15]  (hidden comment: Resistor 10k +/-1% 0603 100 mW)
R30  value 10k  Case/Package: 0603  [RESC1608X55X25NL10T15]  (hidden comment: Resistor 10k +/-1% 0603 100 mW)
R31  value 620  Case/Package: 0603  [RC0603JR-0720KL-Footprint-1]  (hidden comment: RC0603FR-07620RL)
R32  value 10k  Case/Package: 0603  [RESC1608X55X25NL10T15]  (hidden comment: Resistor 10k +/-1% 0603 100 mW)
R33  value 10k  Case/Package: 0603  [RESC1608X55X25NL10T15]  (hidden comment: Resistor 10k +/-1% 0603 100 mW)
R34  value 10k  Case/Package: 0603  [RESC1608X55X25NL10T15]  (hidden comment: Resistor 10k +/-1% 0603 100 mW)
R35  value 10k  Case/Package: 0603  [RESC1608X55X25NL10T15]  (hidden comment: Resistor 10k +/-1% 0603 100 mW)
R36  value 180  Case/Package: 0603  [RESC0603(1608)_N]  (hidden comment: RC0603JR-07180RL)
R37  value 10k  Case/Package: 0603  [RESC1608X55X25NL10T15]  (hidden comment: Resistor 10k +/-1% 0603 100 mW)
U5  LTC4331IUFD#TRPBF  [FP-UFD-20-05-08-1711-IPC_C]

### Ports
ENC_SCL1 (bidir), ENC_SDA1 (bidir), EXTEND_1_A (bidir), EXTEND_1_B (bidir)

### Nets
+5V06: C11.2 C12.2 R22.2 R24.2 R25.2 R26.2 R27.2 R28.1 R29.1 R30.1 R36.2 R37.1 U5.1(VCC) U5.2(VL)
GND: C11.1 C12.1 R31.1 R32.1 R33.1 R34.1 R35.1 U5.16(GND) U5.21(GND)
A1_1: R24.1 R32.2 U5.11(A1)
A2_1: R25.1 R33.2 U5.12(A2)
SPD1_1: R26.1 R34.2 U5.14(SPEED1)
SPD2_1: R27.1 R35.2 U5.15(SPEED2)
NetD4_1: U5.8(SDA) ; port ENC_SDA1
NetD4_2: U5.7(SCL) ; port ENC_SCL1
NetD8_1: D8.1(K) U5.5(~{LINK})
NetD8_2: D8.2(A) R36.1
NetJ2_5: R22.1 R23.2 U5.18(A) ; port EXTEND_1_A
NetJ2_6: R23.1 R31.2 U5.19(B) ; port EXTEND_1_B
NetR28_2: R28.2 U5.17(~{SLO})
NetR29_2: R29.2 U5.10(~{ALERT})
NetR30_2: R30.2 U5.3(ON)
NetR37_2: R37.2 U5.4(REMOTE)

Not connected (* = marked no-connect by the designer): U5 6(~{RDY})* 9(NC)* 13(CTRL)* 20(NC)*

### Layout directives
mark named extender_1: +5V06, A1_1, A2_1, GND, SPD1_1, SPD2_1

### Notes on the sheet
- This means that devices on the teacher board must have a lower (higher priority) address
- Select internal device address through A1, A2, selected 76H
- Select speed through SPEED1, SPEED 2. selected 500kHz
- O.A, E.C

### Library data of the parts
C11 = CMP-001-00004-8: as C9 on sheet I2C extender 0; Mounting Technology: SM; RoHS Compliant: True; Min Operating Temperature: -55°C; Pins: 2; Max Operating Temperature: 125°C; Tolerance: 10%
C12 = CMP-001-00089-2: as C10 on sheet I2C extender 0; Dielectric Material: Ceramic; Tolerance (fill in as +-): 10%; Pins: 2; Package Style: SMTMeter; Max Operating Temperature: 85°C; JESD-609 Code: e3; Termination: Wraparound; Min Operating Temperature: -55°C; RoHS Compliant: Yes; Mounting Technology: Surface Mount; Reach SVHC Compliant: Yes; Terminal Finish: Nickel; Packaging: Tape and Reel; Capacitor Type: Ceramic; Height: 1.35mm; Width: 1.25mm; Temperature Characteristics Code: X5R; Length: 2mm; Tolerance  (fill in as +-): 10%; Package Shape: Rectangular
D8 = CMP-007-00046-1: as D7 on sheet I2C extender 0; Packaging: Tape and Reel; Size: 1.1mm; Max Operating Temperature: 85°C; RoHS Compliant: Yes; Color: Yellow; Pins: 2; Lens Style: WATER CLEAR; Reach SVHC Compliant: Yes; Terminal Pitch: 1.6mm; Mounting Technology: Surface Mount; Min Operating Temperature: -40°C; Optoelectronic Device Type: SINGLE COLOR LED
R22 R31 = CMP-009-00191-1: as R6 on sheet I2C extender 0; Package Shape: Rectangular; Min Operating Temperature: -55°C; Technology: METAL GLAZE/THICK FILM; Reach SVHC Compliant: Yes; Pins: 2; Working Voltage: 75V; Tolerance: 1%; Terminal Finish: Nickel; RoHS Compliant: Yes; Termination: Wraparound; Construction: Chip; JESD-609 Code: e3; Mounting Technology: Surface Mount; Max Operating Temperature: 155°C; Package Style: SMTMeter; Packaging: Tape and Reel; Resistor Type: FIXED RESISTOR
R23 = CMP-009-00190-1: as R7 on sheet I2C extender 0; Termination: Wraparound; JESD-609 Code: e3; RoHS Compliant: Yes; Tolerance: 1%; Max Operating Temperature: 155°C; Package Style: SMTMeter; Terminal Finish: Nickel; Packaging: Tape and Reel; Package Shape: Rectangular; Pins: 2; Working Voltage: 75V; Construction: Chip; Resistor Type: FIXED RESISTOR; Technology: METAL GLAZE/THICK FILM; Reach SVHC Compliant: Yes; Mounting Technology: Surface Mount; Min Operating Temperature: -55°C
R24-R30 R32-R35 R37 = CMP-009-00017-7: as R2 on sheet Power; RoHS Compliant: True; Min Operating Temperature: -55°C; Pins: 2; Mounting Technology: SM; Max Operating Temperature: 155°C; Tolerance: 1%
R36 = CMP-009-00178-1: as R38 on sheet Connectors; Tolerance: 5%; Pins: 2; Mounting Technology: Surface Mount; RoHS Compliant: Yes; Max Operating Temperature: 155°C; Min Operating Temperature: -55°C
U5 = CMP-015-00011-1: as U4 on sheet I2C extender 0; Reach SVHC Compliant: Yes; RoHS Compliant: Yes

## Nets that join several sheets
+5V06: Connectors (7 pins), Power (7 pins), I2C extender 0 (14 pins), I2C extender 1 (14 pins)
+12V0: Connectors (C1.1 D1.2 F2.2), Power (5 pins)
CHASSIS: Main (12 pins), Connectors (J2.9 J2.10)
GND: Main (8 pins), Connectors (19 pins), Power (11 pins), I2C extender 0 (9 pins), I2C extender 1 (9 pins)
NetD3_1: Connectors (D3.1 J1.1 P1.3), I2C extender 0 (U4.8)
NetD3_2: Connectors (D3.2 J1.4 P1.2), I2C extender 0 (U4.7)
NetD4_1: Connectors (D4.1 J4.1 P2.3), I2C extender 1 (U5.8)
NetD4_2: Connectors (D4.2 J4.4 P2.2), I2C extender 1 (U5.7)
NetJ2_5: Connectors (J2.5), I2C extender 1 (R22.1 R23.2 U5.18)
NetJ2_6: Connectors (J2.6), I2C extender 1 (R23.1 R31.2 U5.19)
NetJ2_7: Connectors (J2.7), I2C extender 0 (R6.1 R7.2 U4.18)
NetJ2_8: Connectors (J2.8), I2C extender 0 (R7.1 R15.2 U4.19)

## Assembly variants
REV_A: not fitted C17 C18 C19 C20 F2 F3 R11 R18 R27 R34 R40 R41 R42 R43 R? R? R? R? R? R? R? R? R? R? R?